# Altium schematic sheet RF19_Sensor_CAN_Module_Interfaces.SchDoc
size A4; DocumentNumber: 3; SheetNumber: 3; SheetTotal: 3
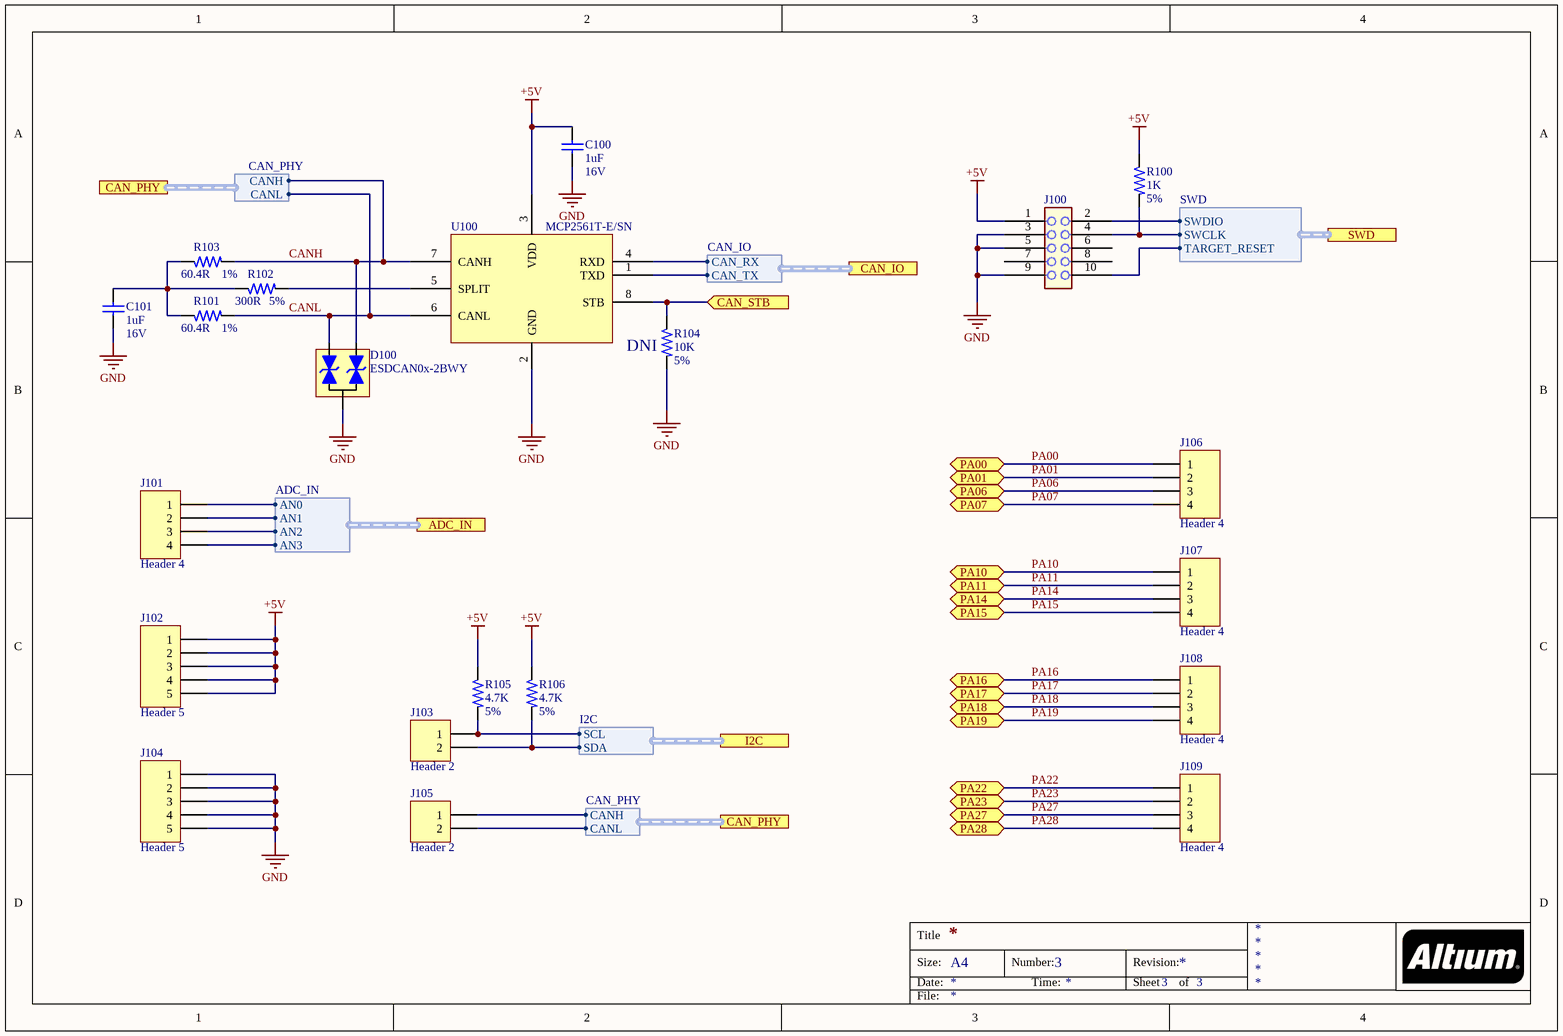
[diagram p0: RF19_Sensor_CAN_Module_Interfaces.SchDoc]

## Parts
C100  value 1uF  Voltage: 16V  [C0402]  (hidden comment: CERAMIC CAP)
C101  value 1uF  Voltage: 16V  [C0402]  (hidden comment: C001U10P16VX5R0402)
D100  ESDCAN0x-2BWY  [SOT323-3L]
J100  (no value)  [5X2 HEADER]
J101  Header 4  [HDR1X4]  (no BOM)
J102  Header 5  [HDR1X5]  (no BOM)
J103  Header 2  [HDR1X2]  (no BOM)
J104  Header 5  [HDR1X5]  (no BOM)
J105  Header 2  [HDR1X2]  (no BOM)
J106  Header 4  [HDR1X4]  (no BOM)
J107  Header 4  [HDR1X4]  (no BOM)
J108  Header 4  [HDR1X4]  (no BOM)
J109  Header 4  [HDR1X4]  (no BOM)
R100  value 1K  Tolerance: 5%  [R0402]  (hidden comment: R001K50P0402063)
R101  value 60.4R  Tolerance: 1%  [R0805]  (hidden comment: R60R410P0805125)
R102  value 300R  Tolerance: 5%  [R0402]  (hidden comment: R300R50P0402063)
R103  value 60.4R  Tolerance: 1%  [R0805]  (hidden comment: R60R410P0805125)
R104  value 10K  Tolerance: 5%  [R0402]  (hidden comment: R010K50P0402063)
R105  value 4.7K  Tolerance: 5%  [R0402]  (hidden comment: R04K750P0402063)
R106  value 4.7K  Tolerance: 5%  [R0402]  (hidden comment: R04K750P0402063)
U100  MCP2561T-E/SN  [SOIC127P600X175-8N]

## Ports
ADC_IN (harness ADC_IN), CAN_IO (harness CAN_IO), CAN_PHY (harness CAN_PHY), CAN_STB (in), I2C (harness I2C), PA00 (bidir), PA01 (bidir), PA06 (bidir), PA07 (bidir), PA10 (bidir), PA11 (bidir), PA14 (bidir), PA15 (bidir), PA16 (bidir), PA17 (bidir), PA18 (bidir), PA19 (bidir), PA22 (bidir), PA23 (bidir), PA27 (bidir), PA28 (bidir), SWD (harness SWD)

## Harnesses
CAN_IO: CAN_RX, CAN_TX
CAN_PHY: CANH, CANL
ADC_IN: AN0, AN1, AN2, AN3
I2C: SCL, SDA
SWD: SWCLK, SWDIO, TARGET_RESET

## Nets
+5V: C100.1 J100.1 J102.1 J102.2 J102.3 J102.4 J102.5 R100.1 R105.1 R106.1 U100.3(VDD)
GND: C100.2 C101.2 D100.3 J100.3 J100.5 J100.9 J104.1 J104.2 J104.3 J104.4 J104.5 R104.2 U100.2(GND)
CAN_STB: R104.1 U100.8(STB) ; port CAN_STB
CANH: D100.1 J105.1 R103.2 U100.7(CANH) ; port CAN_PHY.CANH
CANL: D100.2 J105.2 R101.2 U100.6(CANL) ; port CAN_PHY.CANL
PA00: J106.1 ; port PA00
PA01: J106.2 ; port PA01
PA06: J106.3 ; port PA06
PA07: J106.4 ; port PA07
PA10: J107.1 ; port PA10
PA11: J107.2 ; port PA11
PA14: J107.3 ; port PA14
PA15: J107.4 ; port PA15
PA16: J108.1 ; port PA16
PA17: J108.2 ; port PA17
PA18: J108.3 ; port PA18
PA19: J108.4 ; port PA19
PA22: J109.1 ; port PA22
PA23: J109.2 ; port PA23
PA27: J109.3 ; port PA27
PA28: J109.4 ; port PA28
NetC101_1: C101.1 R101.1 R102.1 R103.1
NetJ100_2: J100.2 ; port SWD.SWDIO
NetJ100_4: J100.4 R100.2 ; port SWD.SWCLK
NetJ100_10: J100.10 ; port SWD.TARGET_RESET
NetJ101_1: J101.1 ; port ADC_IN.AN0
NetJ101_2: J101.2 ; port ADC_IN.AN1
NetJ101_3: J101.3 ; port ADC_IN.AN2
NetJ101_4: J101.4 ; port ADC_IN.AN3
NetJ103_1: J103.1 R105.2 ; port I2C.SCL
NetJ103_2: J103.2 R106.2 ; port I2C.SDA
NetR102_2: R102.2 U100.5(SPLIT)
NetU100_1: U100.1(TXD) ; port CAN_IO.CAN_TX
NetU100_4: U100.4(RXD) ; port CAN_IO.CAN_RX

Not connected (* = marked no-connect by the designer): J100 6 7 8

## Notes on the sheet
- DNI
- Title
- Size:
- Date:
- A4
- Number:
- Time:
- Revision:
- Sheet
- of
- File:

## Library data of the parts
C100 C101 = C001U10P16VX5R0402: Ceramic cap, 1uF +/-10% 16V X5R 0402; Supplier 1: Mouser; Supplier 2: Digi-Key; Supplier Part Number 1: 963-EMK105BJ105KV-F; Supplier Part Number 2: 1276-1067-1-ND
D100 = ESDCAN0x-2BWY: Dual-line Transil TVS diodes for CAN bus; Supplier 1: Mouser; Supplier Part Number 1: 511-ESDCAN03-2BWY
J100 = A08-0385: 2x5 pin header, 1.27mm pitch, THM; PartGroup: Mechanical devices,Connectors,Pin headers; Manufacturer: Garry; MPN: 176-2-010-0-T-XS0-0730; Value: PIN HEADER 2x5; AN: A08-0385; Height: 7,30000019073486; Supplier 1: Mouser; Supplier Part Number 1: 649-221121-00010D4LF
J101 J106-J109 = Header 4: Header, 4-Pin; LatestRevisionDate: 17-Jul-2002; LatestRevisionNote: Re-released for DXP Platform.; Publisher: Altium Limited
J102 J104 = Header 5: Header, 5-Pin; LatestRevisionDate: 17-Jul-2002; LatestRevisionNote: Re-released for DXP Platform.; Publisher: Altium Limited
J103 J105 = Header 2: Header, 2-Pin; LatestRevisionDate: 17-Jul-2002; LatestRevisionNote: Re-released for DXP Platform.; Publisher: Altium Limited
R100 = R001K50P0402063: Resistor 1K 5% 0402 1/16W; ComponentLink1Description: Datasheet; ComponentLink1URL: http://www.yageo.com/documents/recent/PYu-RC_Group_51_RoHS_L_9.pdf; Supplier 1: Mouser; Supplier 2: Digi-Key; Supplier Part Number 1: 603-RC0402JR-071KL; Supplier Part Number 2: 311-1.0KJRDKR-ND
R101 R103 = R60R410P0805125: Resistor 60.4R 1% 0805 1/8W; ComponentLink1Description: Datasheet; ComponentLink1URL: https://www.mouser.ca/datasheet/2/54/hpreztr-777398.pdf; Supplier 1: Mouser; Supplier Part Number 1: 652-CR0805FX-60R4ELF
R102 = R300R50P0402063: Resistor 300R 5% 0402 1/16W; ComponentLink1Description: Datasheet; ComponentLink1URL: http://www.yageo.com/documents/recent/PYu-RC_Group_51_RoHS_L_9.pdf; Supplier 2: Digi-Key; Supplier Part Number 1: 603-RC0402JR-07300RL; Supplier 1: Mouser; Supplier Part Number 2: 311-300JRDKR-ND
R104 = R010K50P0402063: Resistor 10K 5% 0402 1/16W; ComponentLink1Description: Datasheet; ComponentLink1URL: http://www.yageo.com/documents/recent/PYu-RC_Group_51_RoHS_L_9.pdf; Supplier 1: Digi-Key; Supplier Part Number 1: 311-10KJRDKR-ND; Supplier 2: Mouser; Supplier Part Number 2: 603-RC0402JR-0710KL
R105 R106 = R04K750P0402063: Resistor 4.7K 5% 0402 1/16W; ComponentLink1Description: Datasheet; ComponentLink1URL: http://www.yageo.com/documents/recent/PYu-RC_Group_51_RoHS_L_9.pdf; Supplier 1: Mouser; Supplier 2: Digi-Key; Supplier Part Number 1: 603-RC0402JR-074K7L; Supplier Part Number 2: 311-4.7KJRDKR-ND
U100 = MCP2561: High Speed CAN Transceiver; Supplier 1: Mouser; Supplier Part Number 1: 579-MCP2561T-E/SN; Supplier 2: Digi-Key; Supplier Part Number 2: MCP2561T-E/SNCT-ND